# Altium schematic sheet OpenDriver.SchDoc
size A4
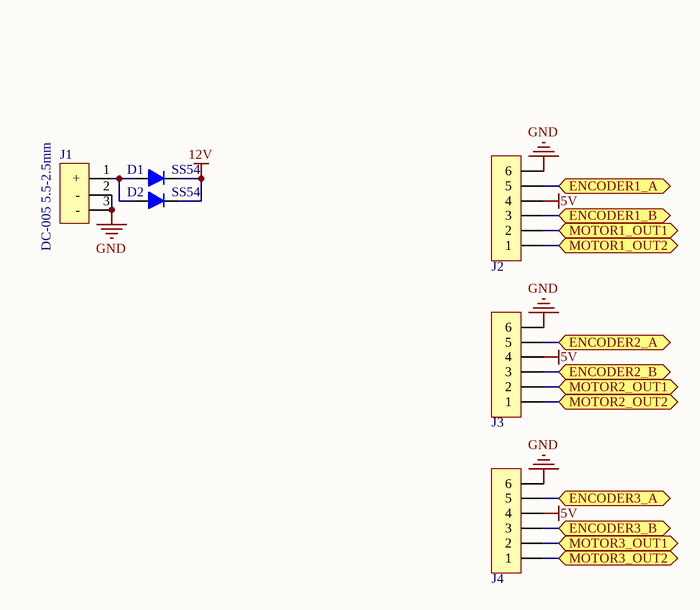
[diagram p0: OpenDriver.SchDoc]

## Parts
D1  SS54  [LC-SMA(DO-214AC)_S2]
D2  SS54  [LC-SMA(DO-214AC)_S2]
J1  DC-005 5.5-2.5mm  [DC10B]
J2  PH2.0-6P  [PH-6P]  (value not drawn)
J3  PH2.0-6P  [PH-6P]  (value not drawn)
J4  PH2.0-6P  [PH-6P]  (value not drawn)

## Ports
ENCODER1_A, ENCODER1_B, ENCODER2_A, ENCODER2_B, ENCODER3_A, ENCODER3_B, MOTOR1_OUT1, MOTOR1_OUT2, MOTOR2_OUT1, MOTOR2_OUT2, MOTOR3_OUT1, MOTOR3_OUT2

## Nets
5V: J2.4 J3.4 J4.4
12V: D1.2(K) D2.2(K)
GND: J1.2(-) J1.3(-) J2.6 J3.6 J4.6
ENCODER1_A: J2.5 ; port ENCODER1_A
ENCODER1_B: J2.3 ; port ENCODER1_B
ENCODER2_A: J3.5 ; port ENCODER2_A
ENCODER2_B: J3.3 ; port ENCODER2_B
ENCODER3_A: J4.5 ; port ENCODER3_A
ENCODER3_B: J4.3 ; port ENCODER3_B
MOTOR1_OUT1: J2.2 ; port MOTOR1_OUT1
MOTOR1_OUT2: J2.1 ; port MOTOR1_OUT2
MOTOR2_OUT1: J3.2 ; port MOTOR2_OUT1
MOTOR2_OUT2: J3.1 ; port MOTOR2_OUT2
MOTOR3_OUT1: J4.2 ; port MOTOR3_OUT1
MOTOR3_OUT2: J4.1 ; port MOTOR3_OUT2
NetD1_1: D1.1(A) D2.1(A) J1.1(+)

## Library data of the parts
D1 D2 = Diode1
J1 = DC-005
J2-J4 = PH2.0_6P